# Altium schematic sheet 2_CircuitBreaker.SchDoc
size A; SheetNumber: 3; SheetTotal: 5
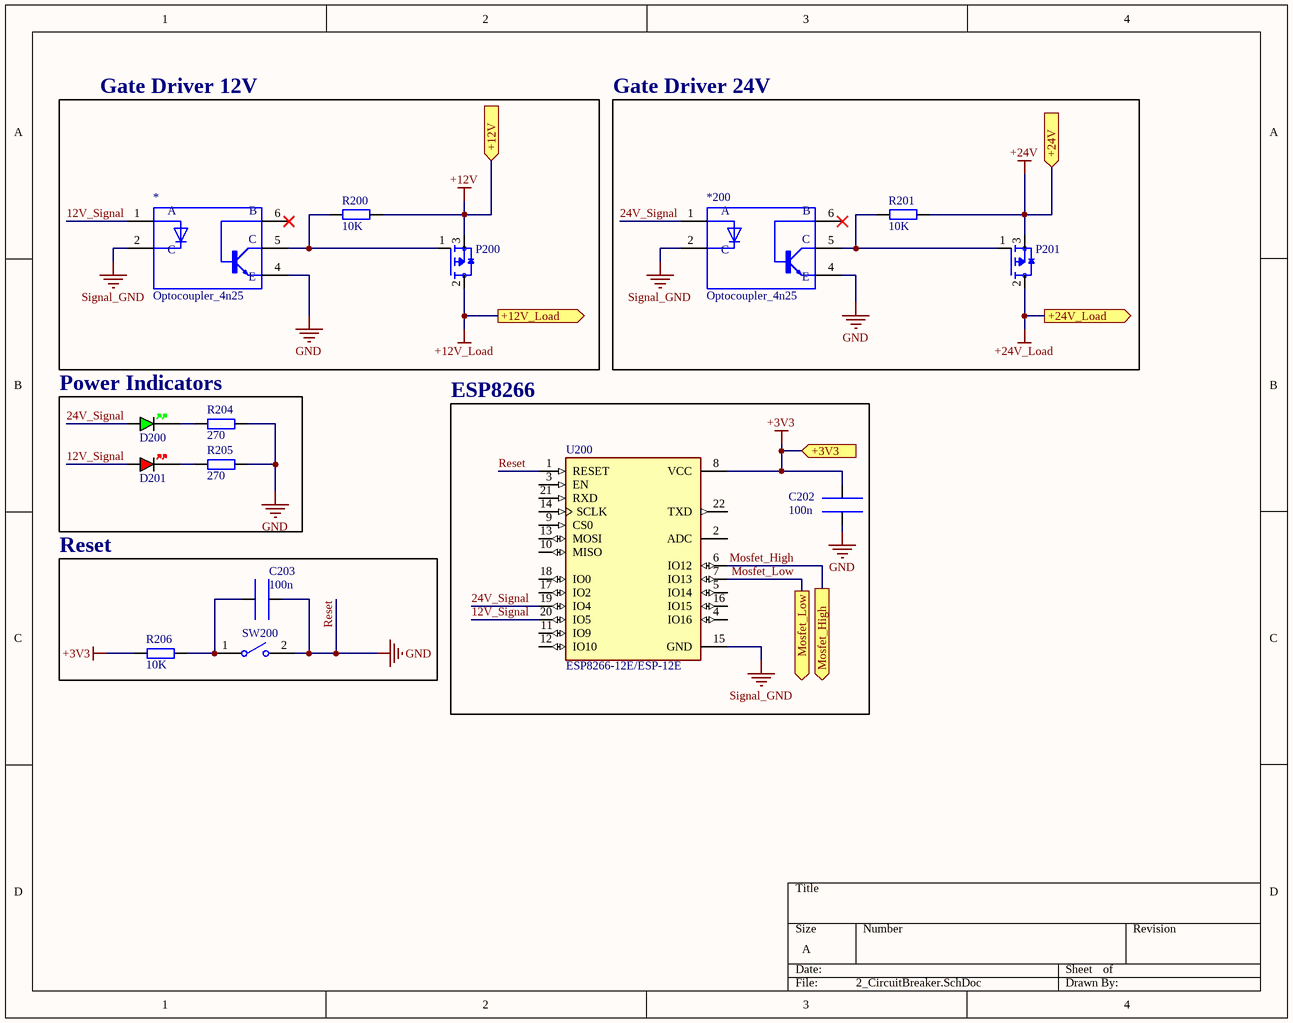
[diagram p0: 2_CircuitBreaker.SchDoc]

## Parts
*  Optocoupler_4n25  [Optocoupler_4n25]
*200  Optocoupler_4n25  [Optocoupler_4n25]
C202  100n  [C0805]
C203  100n  [C0805]
D200  GREEN  [LED_0805_GREEN]  (value not drawn)
D201  RED  [LED_0603_RED]  (value not drawn)
P200  P Mosfet  [Mosfet]  (value not drawn)
P201  P Mosfet  [Mosfet]  (value not drawn)
R200  10K  [RES_1206]
R201  10K  [RES_1206]
R204  270  [RES_0805]
R205  270  [RES_0805]
R206  10K  [RES_1206]
SW200  (no value)  [434121043816]
U200  ESP8266-12E/ESP-12E  [XCVR_ESP8266-12E/ESP-12E]

## Blocks framed on the sheet
Gate Driver 12V: * P200 R200
Gate Driver 24V: *200 P201 R201
Power Indicators: D200 D201 R204 R205
ESP8266: C202 U200
Reset: C203 R206 SW200

## Ports
+3V3 (in, see 0_overview[1B]), +12V (in, see 0_overview[1B], 4_Protection[1A]), +12V_Load (out, see 0_overview[2B], 1_Power[2C]), +24V (in, see 0_overview[1B], 4_Protection[2A]), +24V_Load (out), Mosfet_High (out), Mosfet_Low (out)

## Nets
+3V3: C202.1 R206.2 U200.8(VCC) ; port +3V3
+12V: P200.3(S) R200.1 ; port +12V
+12V_Load: P200.2(D) ; port +12V_Load
+24V: P201.3(S) R201.1 ; port +24V
+24V_Load: P201.2(D) ; port +24V_Load
Reset: *.4(E) *200.4(E) C202.1 C203.1 R204.2 R205.2 SW200.2 U200.1(RESET)  [also labelled GND]
Signal_GND: *.2(C) *200.2(C) U200.15(GND)
12V_Signal: *.1(A) D201.A U200.20(IO5)
24V_Signal: *200.1(A) D200.A U200.19(IO4)
Mosfet_High: U200.6(IO12) ; port Mosfet_High
Mosfet_Low: U200.7(IO13) ; port Mosfet_Low
Net*200_5: *200.5(C`) P201.1(G) R201.2
Net*_5: *.5(C`) P200.1(G) R200.2
NetC203_1: C203.1 R206.1 SW200.1
NetD200_K: D200.K R204.1
NetD201_K: D201.K R205.1

Not connected (* = marked no-connect by the designer): * 6(B)*; *200 6(B)*; U200 2(ADC) 3(EN) 4(IO16) 5(IO14) 9(CS0) 10(MISO) 11(IO9) 12(IO10) 13(MOSI) 14(SCLK) 16(IO15) 17(IO2) 18(IO0) 21(RXD) 22(TXD)

## Library data of the parts
C202 C203 = C0805
D200 = LED_0805_GREEN: LED 0805 GREEN SMD; Manufacturer: *; Manufacturer Part Number: *; Distributor Link: *; LCSC: *
D201 = LED_0603_RED: LED 0603 RED SMD
R200 R201 R206 = RES_1206: Resistor SMD 1206; Manufacturer: *; Manufacturer Part Number: *; Distributor Link: *; LCSC: *
R204 R205 = RES_0805: Resistor SMD 0805; Manufacturer: *; Manufacturer Part Number: *; Distributor Link: *; LCSC: *
SW200 = CMP-1459-00005-3: Switch Tactile Spst-no 0.05A 12V; Contact Resistance: 100mΩ; Current Rating: 50mA; Operating Force: 160N; Packaging: Tape and Reel; Width: 6mm; Voltage Rating: 12V; Min Operating Temperature: -40°C; RoHS: Compliant; Height: 4.3mm; Insulation Resistance: 100MΩ; Contact Plating: Silver; Contact Current Rating: 50mA; Max Operating Temperature: 85°C
U200 = ESP8266-12E/ESP-12E: This WiFi module has a 32-bit MCU micro and clock speeds supporting 80 MHz or 160 MHz. Supports the RTOS and integrated Wi-Fi MAC/BB/RF/PA/LNA, and has an on-board antenna.; MF: AI-Thinker; Value: *; SnapEDA_Link: https://www.snapeda.com/parts/ESP8266-12E/ESP-12E/AI-Thinker/view-part/?ref=snap; Availability: Not in stock; Price: None; Package: None; Check_prices: https://www.snapeda.com/parts/ESP8266-12E/ESP-12E/AI-Thinker/view-part/?ref=eda; MP: ESP8266-12E/ESP-12E